# EAGLE design Power_Board (EAGLE 8.4.1)
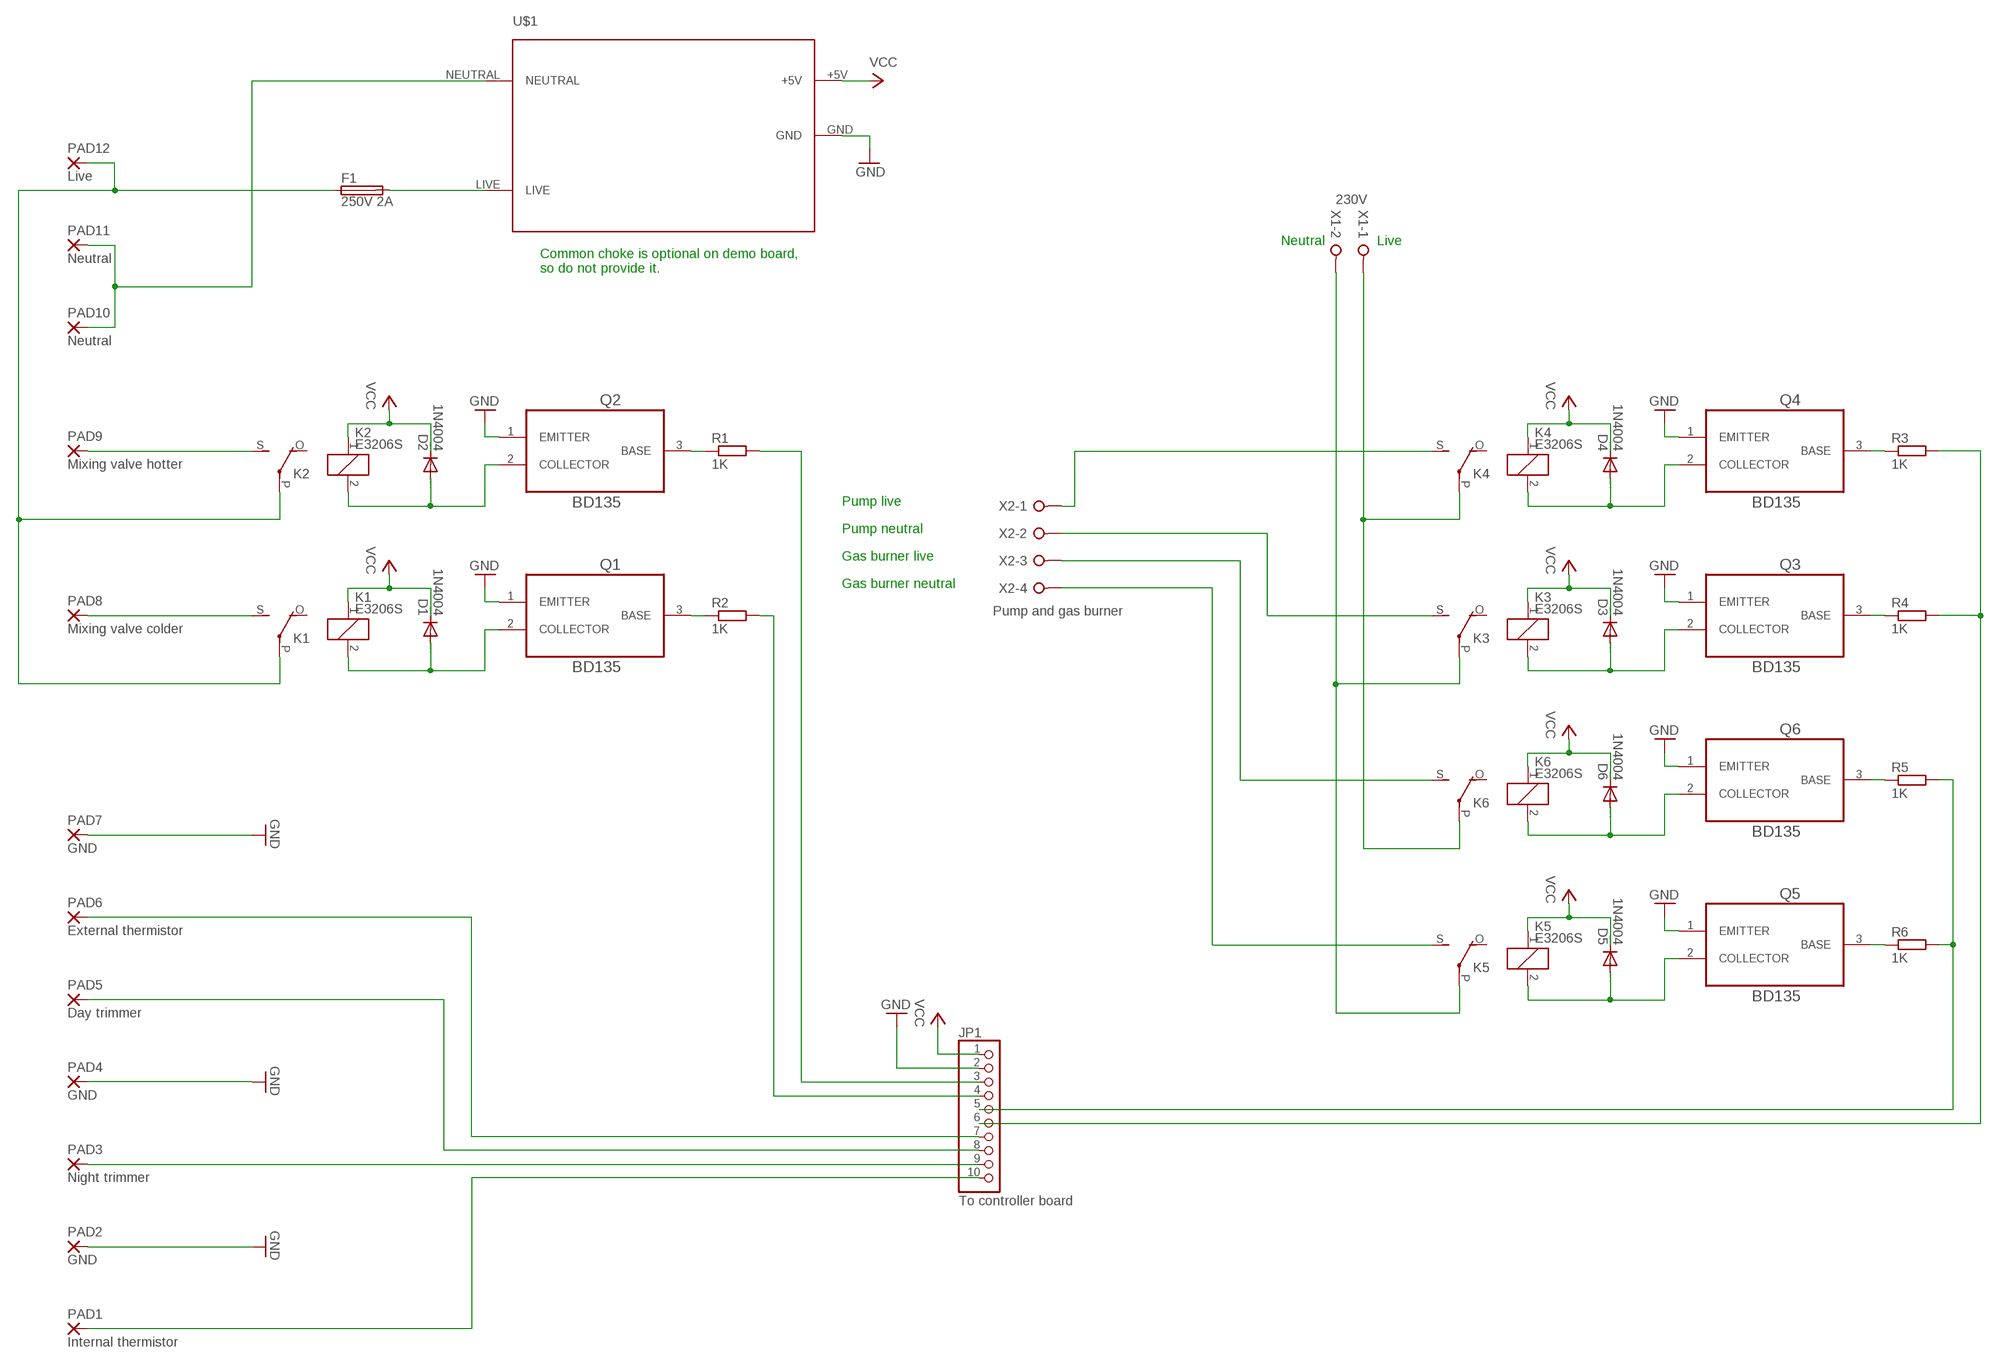
[diagram p0: schematic, sheet 1]

## Parts
D1  1N4004  [DO41-10]
D2  1N4004  [DO41-10]
D3  1N4004  [DO41-10]
D4  1N4004  [DO41-10]
D5  1N4004  [DO41-10]
D6  1N4004  [DO41-10]
F1  250V 2A  GSH15  [GSH15]
JP1  To controller board  PINHD-1X10  [1X10]
K1  E3206S  [E3206S]
K2  E3206S  [E3206S]
K3  E3206S  [E3206S]
K4  E3206S  [E3206S]
K5  E3206S  [E3206S]
K6  E3206S  [E3206S]
PAD1  Internal thermistor  SMD20  [SMD2,54-20,32]
PAD2  GND  SMD20  [SMD2,54-20,32]
PAD3  Night trimmer  SMD20  [SMD2,54-20,32]
PAD4  GND  SMD20  [SMD2,54-20,32]
PAD5  Day trimmer  SMD20  [SMD2,54-20,32]
PAD6  External thermistor  SMD20  [SMD2,54-20,32]
PAD7  GND  SMD20  [SMD2,54-20,32]
PAD8  Mixing valve colder  SMD20  [SMD2,54-20,32]
PAD9  Mixing valve hotter  SMD20  [SMD2,54-20,32]
PAD10  Neutral  SMD20  [SMD2,54-20,32]
PAD11  Neutral  SMD20  [SMD2,54-20,32]
PAD12  Live  SMD20  [SMD2,54-20,32]
Q1  BD135  [TRANS_BD135]
Q2  BD135  [TRANS_BD135]
Q3  BD135  [TRANS_BD135]
Q4  BD135  [TRANS_BD135]
Q5  BD135  [TRANS_BD135]
Q6  BD135  [TRANS_BD135]
R1  1K  R-EU_0207/10  [0207/10]
R2  1K  R-EU_0207/10  [0207/10]
R3  1K  R-EU_0207/10  [0207/10]
R4  1K  R-EU_0207/10  [0207/10]
R5  1K  R-EU_0207/10  [0207/10]
R6  1K  R-EU_0207/10  [0207/10]
U$1  VTX-214-010-205  [VTX-214-010-205]
X1  230V  W237-02P  [W237-132]
X2  Pump and gas burner  W237-04P  [W237-4P]

## Nets
GND: JP1.2 PAD2.1(P) PAD4.1(P) PAD7.1(P) Q1.1(EMITTER) Q2.1(EMITTER) Q3.1(EMITTER) Q4.1(EMITTER) Q5.1(EMITTER) Q6.1(EMITTER) U$1.GND
N$1: JP1.8 PAD5.1(P)
N$2: JP1.10 PAD1.1(P)
N$3 [power]: K1.S(2:S) PAD8.1(P)
N$4: D1.A K1.2 Q1.2(COLLECTOR)
N$5: Q2.3(BASE) R1.1
N$6 [power]: K2.S(2:S) PAD9.1(P)
N$7: D2.A K2.2 Q2.2(COLLECTOR)
N$8: JP1.7 PAD6.1(P)
N$9: JP1.4 R2.2
N$10 [power]: F1.1 K1.P(2:P) K2.P(2:P) PAD12.1(P)
N$11 [power]: K5.S(2:S) X2.4
N$12 [power]: K3.S(2:S) X2.2
N$13: D3.A K3.2 Q3.2(COLLECTOR)
N$14 [power]: K4.S(2:S) X2.1
N$15: D4.A K4.2 Q4.2(COLLECTOR)
N$16: Q1.3(BASE) R2.1
N$17: D5.A K5.2 Q5.2(COLLECTOR)
N$18 [power]: K6.S(2:S) X2.3
N$19: D6.A K6.2 Q6.2(COLLECTOR)
N$20: Q5.3(BASE) R6.1
N$21: Q6.3(BASE) R5.1
N$22: Q3.3(BASE) R4.1
N$23: JP1.5 R5.2 R6.2
N$24: Q4.3(BASE) R3.1
N$25 [power]: K4.P(2:P) K6.P(2:P) X1.1
N$26: JP1.6 R3.2 R4.2
N$27 [power]: PAD10.1(P) PAD11.1(P) U$1.NEUTRAL
N$28 [power]: K3.P(2:P) K5.P(2:P) X1.2
N$29 [power]: F1.2 U$1.LIVE
N$30: JP1.3 R1.2
PIN4: JP1.9 PAD3.1(P)
VCC: D1.C D2.C D3.C D4.C D5.C D6.C JP1.1 K1.1 K2.1 K3.1 K4.1 K5.1 K6.1 U$1.+5V
Unconnected: K1.O(2:O) K2.O(2:O) K3.O(2:O) K4.O(2:O) K5.O(2:O) K6.O(2:O)

## Notes on the sheet
- Neutral | Live
- Common choke is optional on demo board,
  so do not provide it.
- Pump live
- Pump neutral
- Gas burner live
- Gas burner neutral

## Library data of the parts
D1-D6 = diode:1N4004: DIODE general purpose rectifier, 1 A
F1 = fuse:GSH15: FUSE HOLDER grid 15mm, 19649 Wickmann; MPN: 64900001039; OC_FARNELL: 1271673; OC_NEWARK: 02P0318
JP1 = pinhead:PINHD-1X10: PIN HEADER
K1-K6 = relay:E3206S: RELAY 1 x switch, Eichhoff/distributor Schukat; OC_FARNELL: unknown; OC_NEWARK: unknown
PAD1-PAD12 = Pad:SMD20: SMD PAD
Q1-Q6 = BD135:BD135: TRANSISTOR, NPN, TO-126; MPN: BD135; OC_FARNELL: 1574347; OC_NEWARK: 08N7620; PACKAGE: TO-126; SUPPLIER: MULTICOMP
R1-R6 = resistor:R-EU_: RESISTOR, European symbol
U$1 = VTX-214-010-205:VTX-214-010-205: Vigortronix AC/DC converter 230V to 5V@2A. Eagle part made by Adrien RICCIARDI.
X1 = con-wago-508:W237-02P: WAGO SREW CLAMP; OC_FARNELL: unknown; OC_NEWARK: unknown
X2 = con-wago-508:W237-04P: WAGO SREW CLAMP; OC_FARNELL: unknown; OC_NEWARK: unknown

## Net classes
1 power: width 3 mm, drill 1 mm, clearance 1 mm

## Board
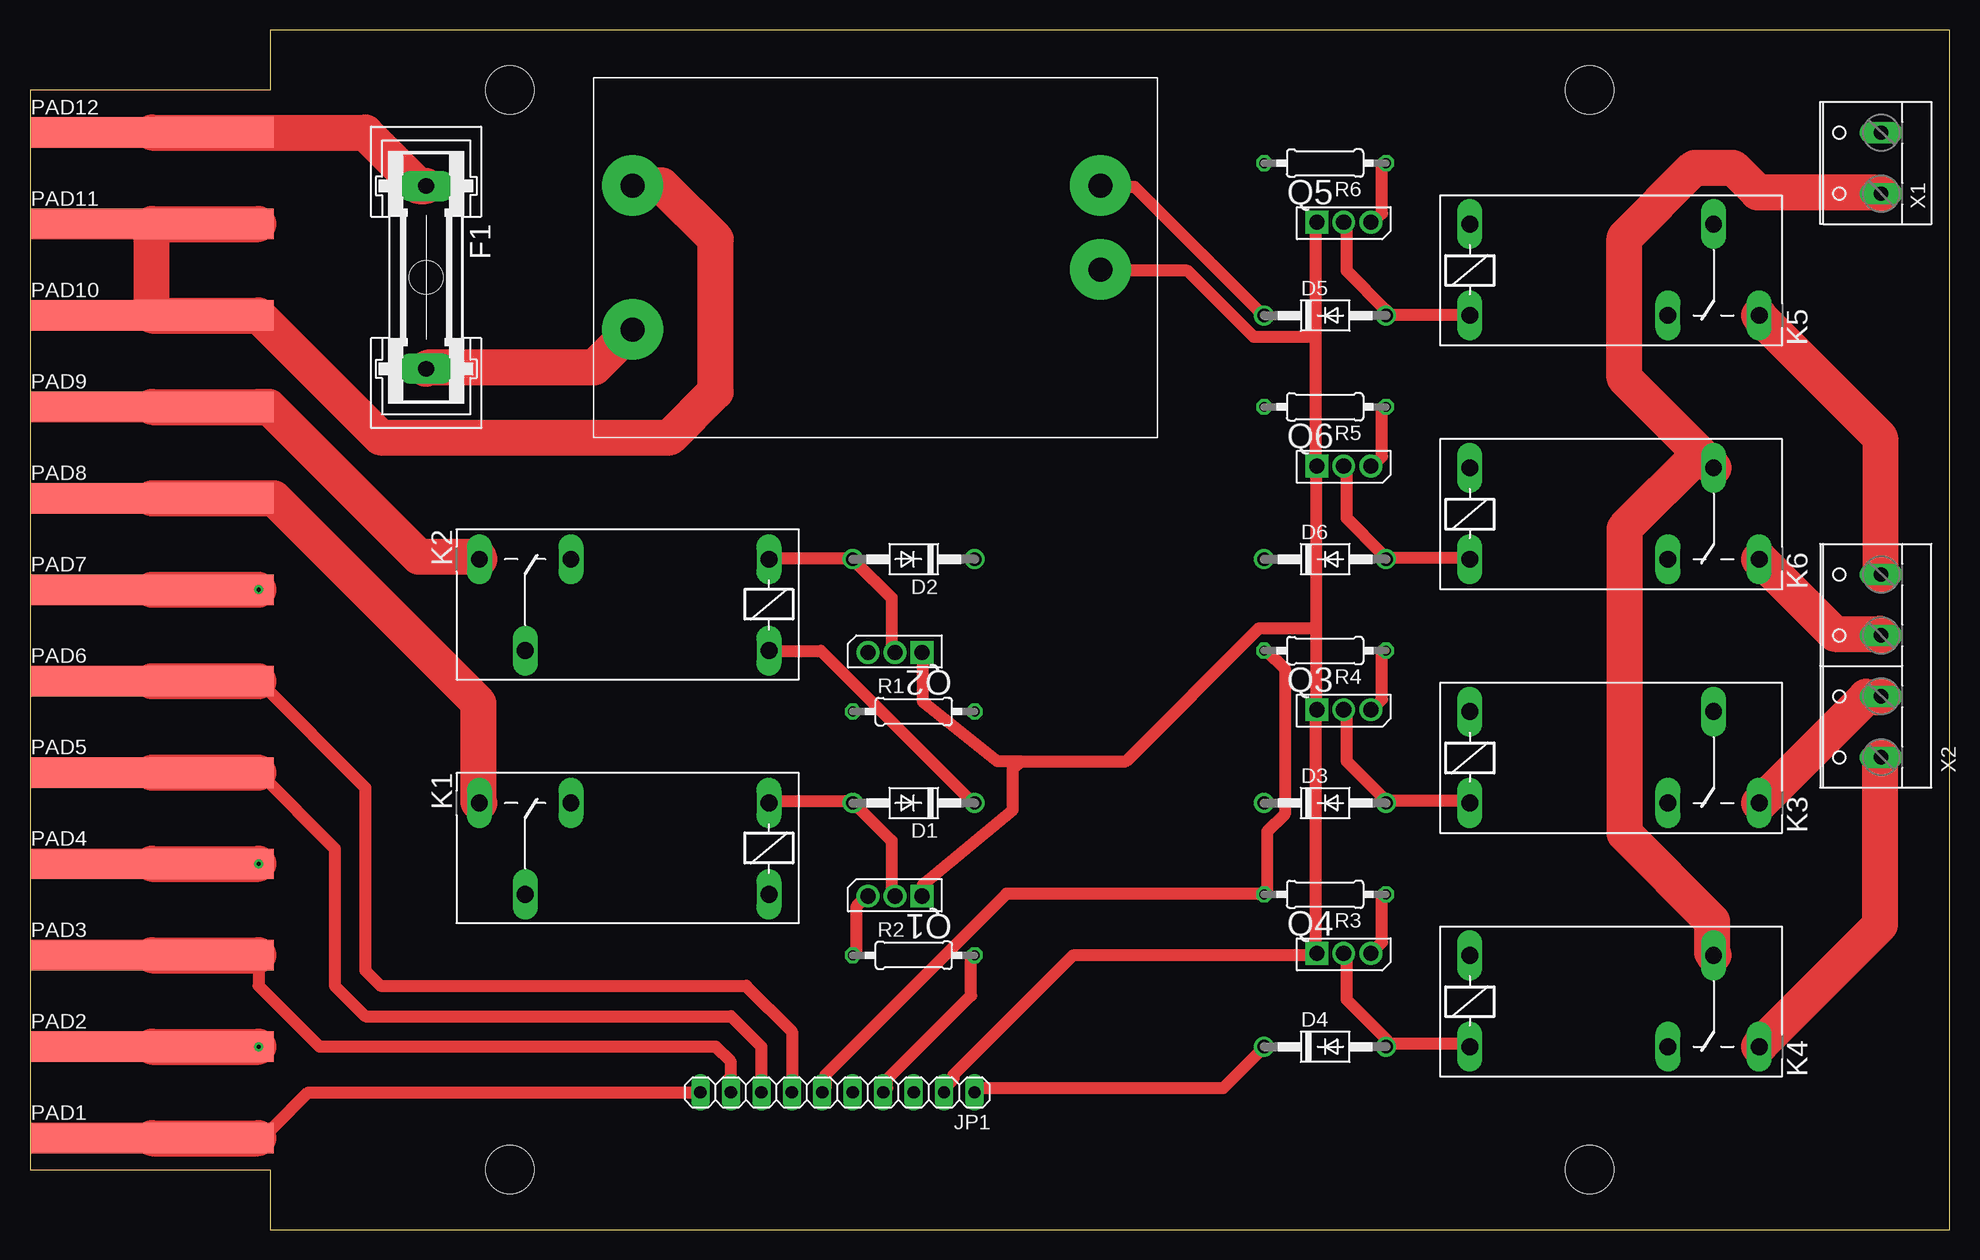
[diagram p1: board, top side]
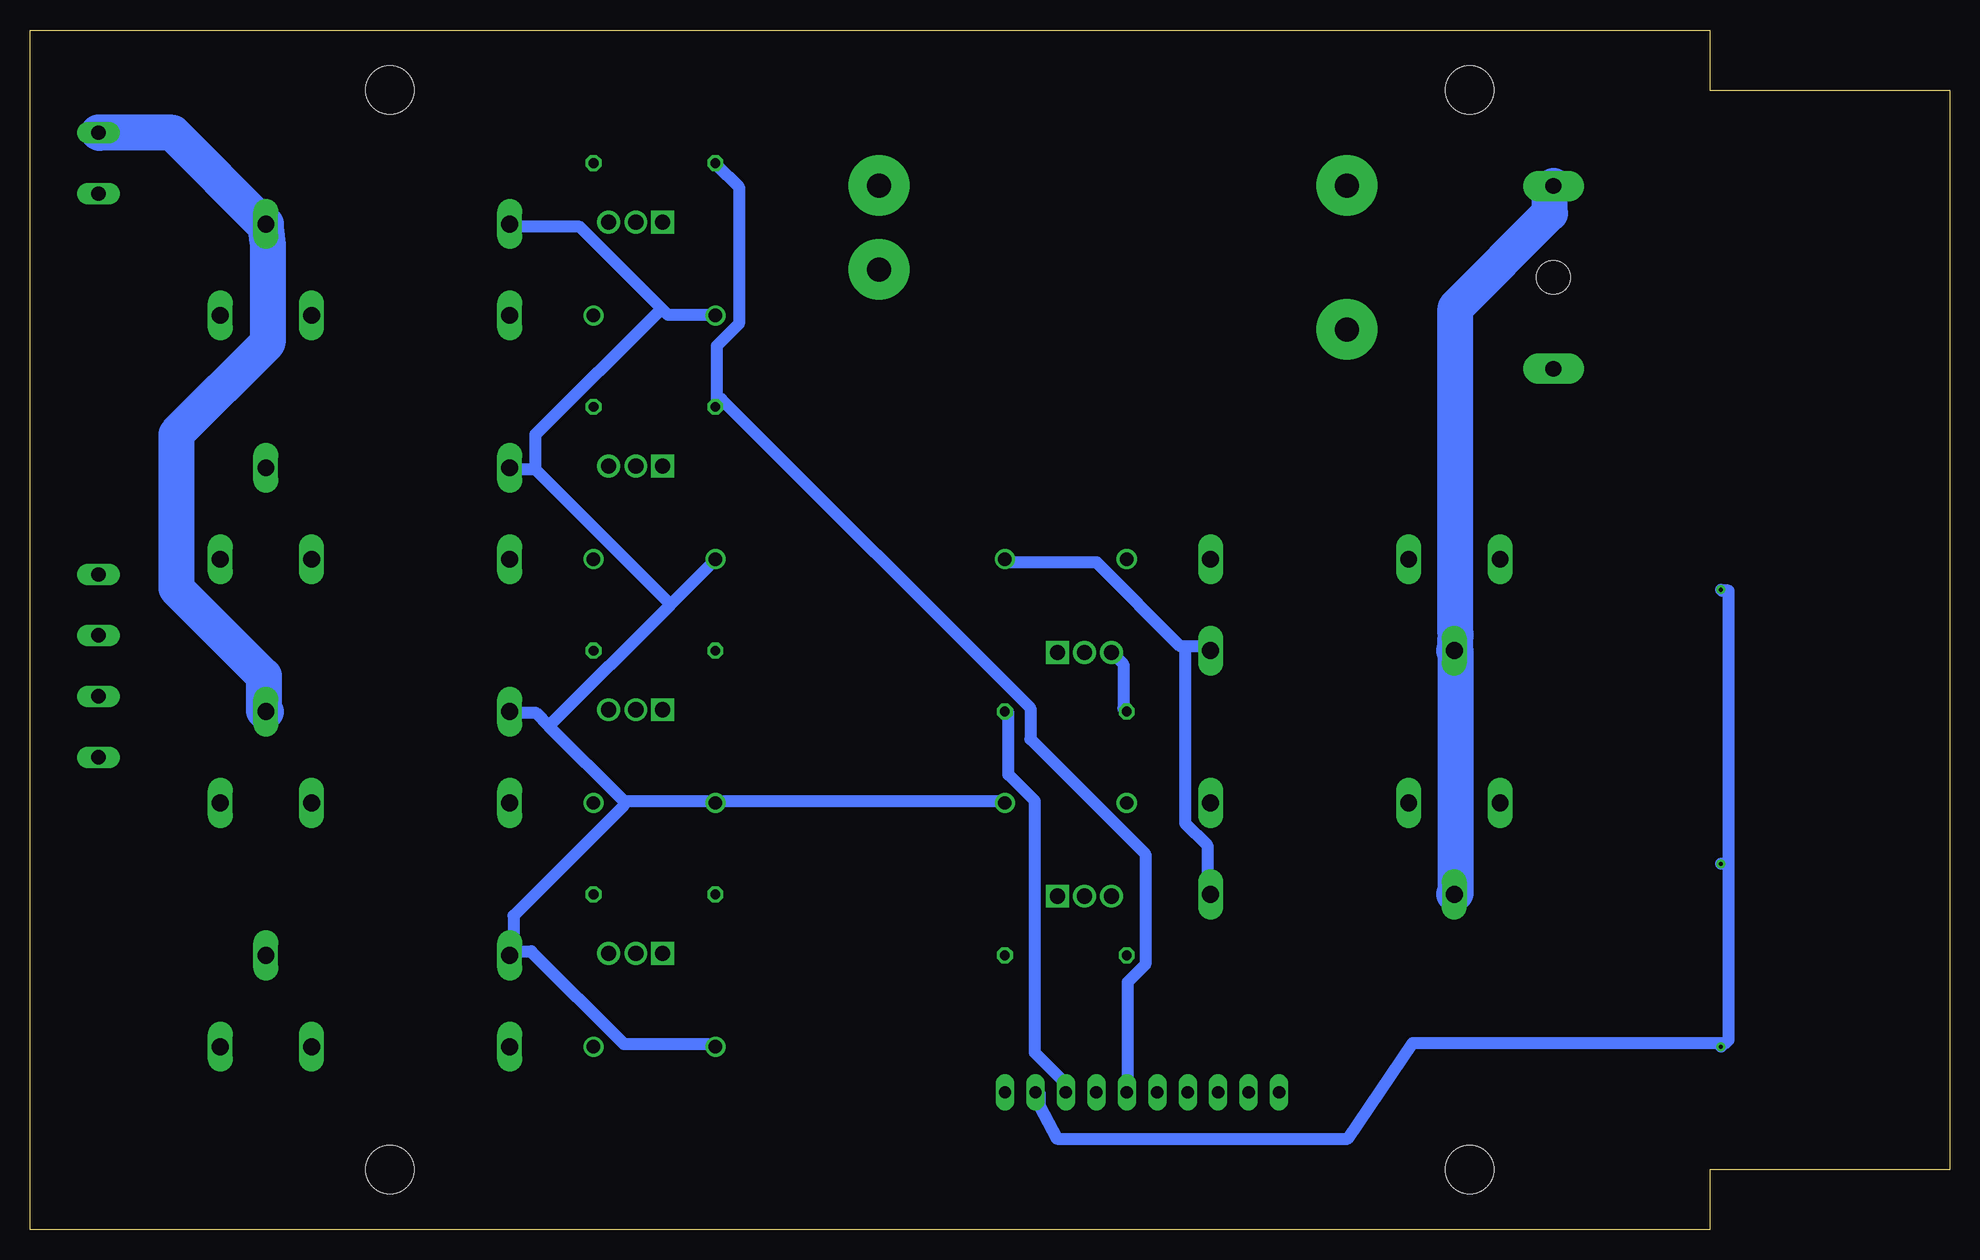
[diagram p2: board, bottom side, seen from below]

Size 160 x 100 mm. Coordinates in mm from the lower left corner, seen from the top.
Outline: 0,5 20,5 20,0 160,0 160,100 20,100 20,95 0,95 0,5
Copper layers (1*16): Top 0.035mm / dielectric 1.5mm / Bottom 0.035mm
Design rules "default *": minimum track width 40mil, minimum drill 0.35mm, track to track 18mil, track to pad 14mil, pad to pad 6mil, via to via 6mil, smd to smd 6mil, copper to edge 40mil, drill to drill 6mil, minimum pad ring 10mil, minimum via ring 8mil, stop-mask expansion 4mil, vias tented up to drill 0mil, thermal gap 10mil
Holes 4 mm at 130,95 130,5 40,5 40,95

### Footprints (pad centres in the part's own frame; a part is rotated, then mirrored left to right if it is on the bottom)
DO41-10 = drill 1.118: A 5.08,0; C -5.08,0
GSH15 = drill 1.321 pad 2.54 long: 1 -7.62,0; 2 7.62,0 | hole 2.794: 0,0
1X10 = drill 1.016 long: 1 -11.43,0; 2 -8.89,0; 3 -6.35,0; 4 -3.81,0; 5 -1.27,0; 6 1.27,0; 7 3.81,0; 8 6.35,0; 9 8.89,0; 10 11.43,0
E3206S = drill 1.397 long: 1 -3.175,3.81; 2 -3.175,-3.81; O 13.335,-3.81; P 17.145,3.81; S 20.955,-3.81
SMD2,54-20,32 = smd 2.54 x 20.32: 1 0,7.62
TRANS_BD135 = drill 1.27 square: 1 -4.496,0.152 | drill 1.27: 2 -2.261,0.152; 3 0,0.152
0207/10 = drill 0.813 octagon: 1 -5.08,0; 2 5.08,0
VTX-214-010-205 = drill 2 pad 5.08: +5V 42.25,21; GND 42.25,14; LIVE 3.25,9; NEUTRAL 3.25,21
W237-132 = drill 1.194 long: 1 -2.54,-0.635; 2 2.54,-0.635
W237-4P = drill 1.194 long: 1 -7.62,-0.635; 2 -2.54,-0.635; 3 2.54,-0.635; 4 7.62,-0.635

### Placement (x,y rotation side)
D1  73.66,35.56 180 top
D2  73.66,55.88 180 top
D3  107.95,35.56 0 top
D4  107.95,15.24 0 top
D5  107.95,76.2 0 top
D6  107.95,55.88 0 top
F1  33.02,79.38 270 top
JP1  67.31,11.43 180 top
K1  58.42,31.75 180 top
K2  58.42,52.07 180 top
K3  123.19,39.37 0 top
K4  123.19,19.05 0 top
K5  123.19,80.01 0 top
K6  123.19,59.69 0 top
PAD1  2.54,7.62 270 top
PAD2  2.54,15.24 270 top
PAD3  2.54,22.86 270 top
PAD4  2.54,30.48 270 top
PAD5  2.54,38.1 270 top
PAD6  2.54,45.72 270 top
PAD7  2.54,53.34 270 top
PAD8  2.54,60.96 270 top
PAD9  2.54,68.58 270 top
PAD10  2.54,76.2 270 top
PAD11  2.54,83.82 270 top
PAD12  2.54,91.44 270 top
Q1  69.85,27.94 180 top
Q2  69.85,48.26 180 top
Q3  111.76,43.18 0 top
Q4  111.76,22.86 0 top
Q5  111.76,83.82 0 top
Q6  111.76,63.5 0 top
R1  73.66,43.18 0 top
R2  73.66,22.86 0 top
R3  107.95,27.94 180 top
R4  107.95,48.26 180 top
R5  107.95,68.58 180 top
R6  107.95,88.9 180 top
U$1  46.99,66.04 0 top
X1  153.67,88.9 90 top
X2  153.67,46.99 90 top

### Tracks (layer width: path | path; a pad name or v marks a point on that pad's centre or on a via)
GND  (via drill 0.35)
  Top 1.016: Q1.1 74.4,27.99 74.4,28.73 81.93,34.99 81.93,38.42 82.55,39.04 | Q2.1 74.4,47.88 74.4,44.03 80.66,39.04 82.55,39.04 | 107.17,50.09 107.17,63.35 Q6.1 107.17,64.08 107.17,74.4 | 107.17,50.09 107.17,43.46 Q3.1 107.17,43.09 107.17,23.2 Q4.1 107.17,22.84 86.92,22.84 76.97,12.89 76.97,12.52 76.24,11.79 JP1.2 | 107.17,74.4 107.17,83.97 Q5.1 | 107.17,74.4 102.02,74.4 96.5,79.92 89.5,79.92 U$1.GND | 82.55,39.04 91.34,39.04 102.39,50.09 107.17,50.09
  Top 3: PAD7.1 v19.05,53.34 | PAD4.1 v19.05,30.48 | PAD2.1 v19.05,15.24
  Bottom 1.016: 18.67,53.2 18.43,53.26 | 18.75,15.54 44.73,15.54 50.16,7.57 74.4,7.57 75.87,10.31 75.87,11.42 JP1.2 | 18.43,53.26 18.43,30.48 | 18.43,30.48 18.43,15.79 18.67,15.54 18.75,15.54 | 18.43,53.26 18.97,53.26 v19.05,53.34 | 18.43,30.48 v19.05,30.48 | 18.75,15.54 v19.05,15.24
N$1
  Top 1.016: 60.77,12.15 60.77,11.79 JP1.8 60.96,15.24 58.42,17.78 27.94,17.78 25.4,20.32 25.4,31.75 19.05,38.1
  Top 3: PAD5.1 19.05,38.1
N$2
  Top 1.016: JP1.10 55.61,11.42 23.2,11.42 20.26,8.47 19.05,7.62
  Top 3: PAD1.1 19.05,7.62
N$3
  Top 3: K1.S 37.39,35.64 37.39,43.89 20.32,60.96 PAD8.1
N$4
  Top 1.016: K1.2 61.87,35.73 68.5,35.73 D1.A 68.87,35.36 71.82,32.41 71.82,27.99 Q1.2
N$5
  Bottom 1.016: R1.1 68.87,43.46 68.87,47.14 69.61,47.88 Q2.3
N$6
  Top 3: K2.S 37.39,56.08 32.42,56.08 19.93,68.58 | 19.93,68.58 19.05,68.58 | PAD9.1 19.93,68.58
N$7
  Top 1.016: K2.2 61.87,55.98 68.5,55.98 D2.A 68.87,55.61 71.82,52.67 71.82,48.25 Q2.2
N$8
  Top 1.016: 19.05,45.72 27.94,36.83 27.94,21.59 29.21,20.32 59.69,20.32 63.5,16.51 JP1.7
  Top 3: PAD6.1 19.05,45.72
N$9
  Top 1.016: R2.2 78.45,22.84 78.45,19.52 71.45,12.52 71.45,11.79 JP1.4
N$10
  Top 3: F1.1 32.38,87 27.94,91.44 PAD12.1
  Bottom 3: K1.P 41.19,28.04 41.19,48.2 K2.P 41.19,49.66 41.19,76.82 33.3,84.71 33.3,86.75 F1.1
N$11
  Top 3: X2.4 154.23,54.62 154.23,66.02 144.3,75.95 K5.S
N$12
  Top 3: X2.2 154.23,44.4 153.06,44.4 144.3,35.64 K3.S
N$13
  Top 1.016: K3.2 119.7,35.73 113.07,35.73 D3.A 112.7,36.09 109.75,39.04 109.75,43.09 Q3.2
N$14
  Top 3: X2.1 154.23,39.14 154.23,25.41 144.3,15.48 K4.S
N$15
  Top 1.016: K4.2 119.7,15.47 113.07,15.47 D4.A 113.07,15.84 109.75,19.15 109.75,22.84 Q4.2
N$16
  Top 1.016: R2.1 68.87,23.2 68.87,26.89 69.61,27.62 Q1.3
N$17
  Top 1.016: K5.2 119.7,76.24 113.07,76.24 D5.A 113.07,76.61 109.75,79.92 109.75,83.97 Q5.2
N$18
  Top 3: X2.3 154.23,49.66 150.43,49.66 144.3,55.79 K6.S
N$19
  Top 1.016: K6.2 119.7,55.98 113.07,55.98 D6.A 112.7,56.35 109.75,59.3 109.75,63.35 Q6.2
N$20
  Top 1.016: R6.1 112.7,88.76 112.7,84.71 111.96,83.97 Q5.3
N$21
  Top 1.016: R5.1 112.7,68.5 112.7,64.45 111.96,63.72 Q6.3
N$22
  Top 1.016: R4.1 112.7,48.25 112.7,44.2 111.96,43.46 Q3.3
N$23
  Bottom 1.016: 102.76,69.24 102.76,73.66 100.91,75.5 100.91,86.92 102.76,88.76 R6.2 | 102.76,69.24 102.76,68.87 R5.2 | JP1.5 68.5,11.79 68.5,20.62 67.03,22.1 67.03,31.3 76.61,40.88 76.61,43.46 102.39,69.24 102.76,69.24
N$24
  Top 1.016: R3.1 112.7,27.62 112.7,23.94 111.96,23.2 Q4.3
N$25
  Top 3: 139.19,64.7 140.21,63.68 K6.P | 139.19,64.7 132.91,70.98 132.91,82.66 138.75,88.51 141.96,88.51 144,86.46 154.23,86.46 X1.1 | 139.19,64.7 132.91,58.42 132.91,33.01 140.21,25.7 140.21,23.08 K4.P
N$26
  Top 1.016: R4.2 103.12,48.25 104.6,46.77 104.6,34.62 103.12,33.15 103.12,27.99 R3.2 102.39,27.99 81.39,27.99 66.29,12.89 66.29,11.79 JP1.6
N$27
  Top 3: 49.95,87.05 U$1.NEUTRAL 52.66,87.04 57.15,82.55 57.15,69.85 53.34,66.04 29.21,66.04 19.05,76.2 PAD10.1 PAD11.1 19.05,83.82
N$28
  Bottom 3: X1.2 154.23,91.43 148.09,91.43 140.5,83.83 K5.P 140.21,82.37 140.21,73.9 147.8,66.31 147.8,53.45 140.5,46.15 140.5,43.23 K3.P
N$29
  Top 3: F1.2 33.3,71.86 47.03,71.86 49.95,74.78 U$1.LIVE
N$30
  Bottom 1.016: JP1.3 73.66,12.15 76.24,14.73 76.24,35.73 78.45,37.94 78.45,43.09 R1.2
PIN4
  Top 1.016: 58.19,12.52 58.19,11.79 JP1.9 58.42,13.97 57.15,15.24 24.13,15.24 19.05,20.32 19.05,22.86
  Top 3: PAD3.1 19.05,22.86
VCC
  Top 1.016: D5.C 102.76,76.24 92.08,86.92 89.5,86.92 U$1.+5V | D1.C 78.45,35.73 65.93,48.25 61.87,48.25 K2.1 | JP1.1 78.82,11.79 99.44,11.79 102.76,15.1 D4.C
  Bottom 1.016: 107.36,76.79 106.81,76.24 103.12,76.24 D5.C | 107.36,76.79 114.17,83.6 119.7,83.6 K5.1 | 63.72,48.62 61.87,48.62 K2.1 | 63.72,48.62 64.08,48.62 71.08,55.61 78.45,55.61 D2.C | 63.72,48.62 63.72,33.88 61.87,32.04 61.87,27.99 K1.1 | 110.49,35.73 103.12,35.73 D3.C 102.39,35.73 78.82,35.73 D1.C | 116.75,41.99 117.86,43.09 119.7,43.09 K3.1 | 116.75,41.99 110.49,35.73 | 116.75,41.99 106.62,52.11 | 106.62,52.11 103.12,55.61 D6.C | 110.49,35.73 110.49,35.36 119.7,26.15 119.7,23.2 K4.1 119.33,23.2 118.22,23.2 110.49,15.47 103.12,15.47 D4.C | 117.86,63.35 119.7,63.35 K6.1 | 106.62,52.11 117.86,63.35 | 107.36,76.79 117.86,66.29 117.86,63.35